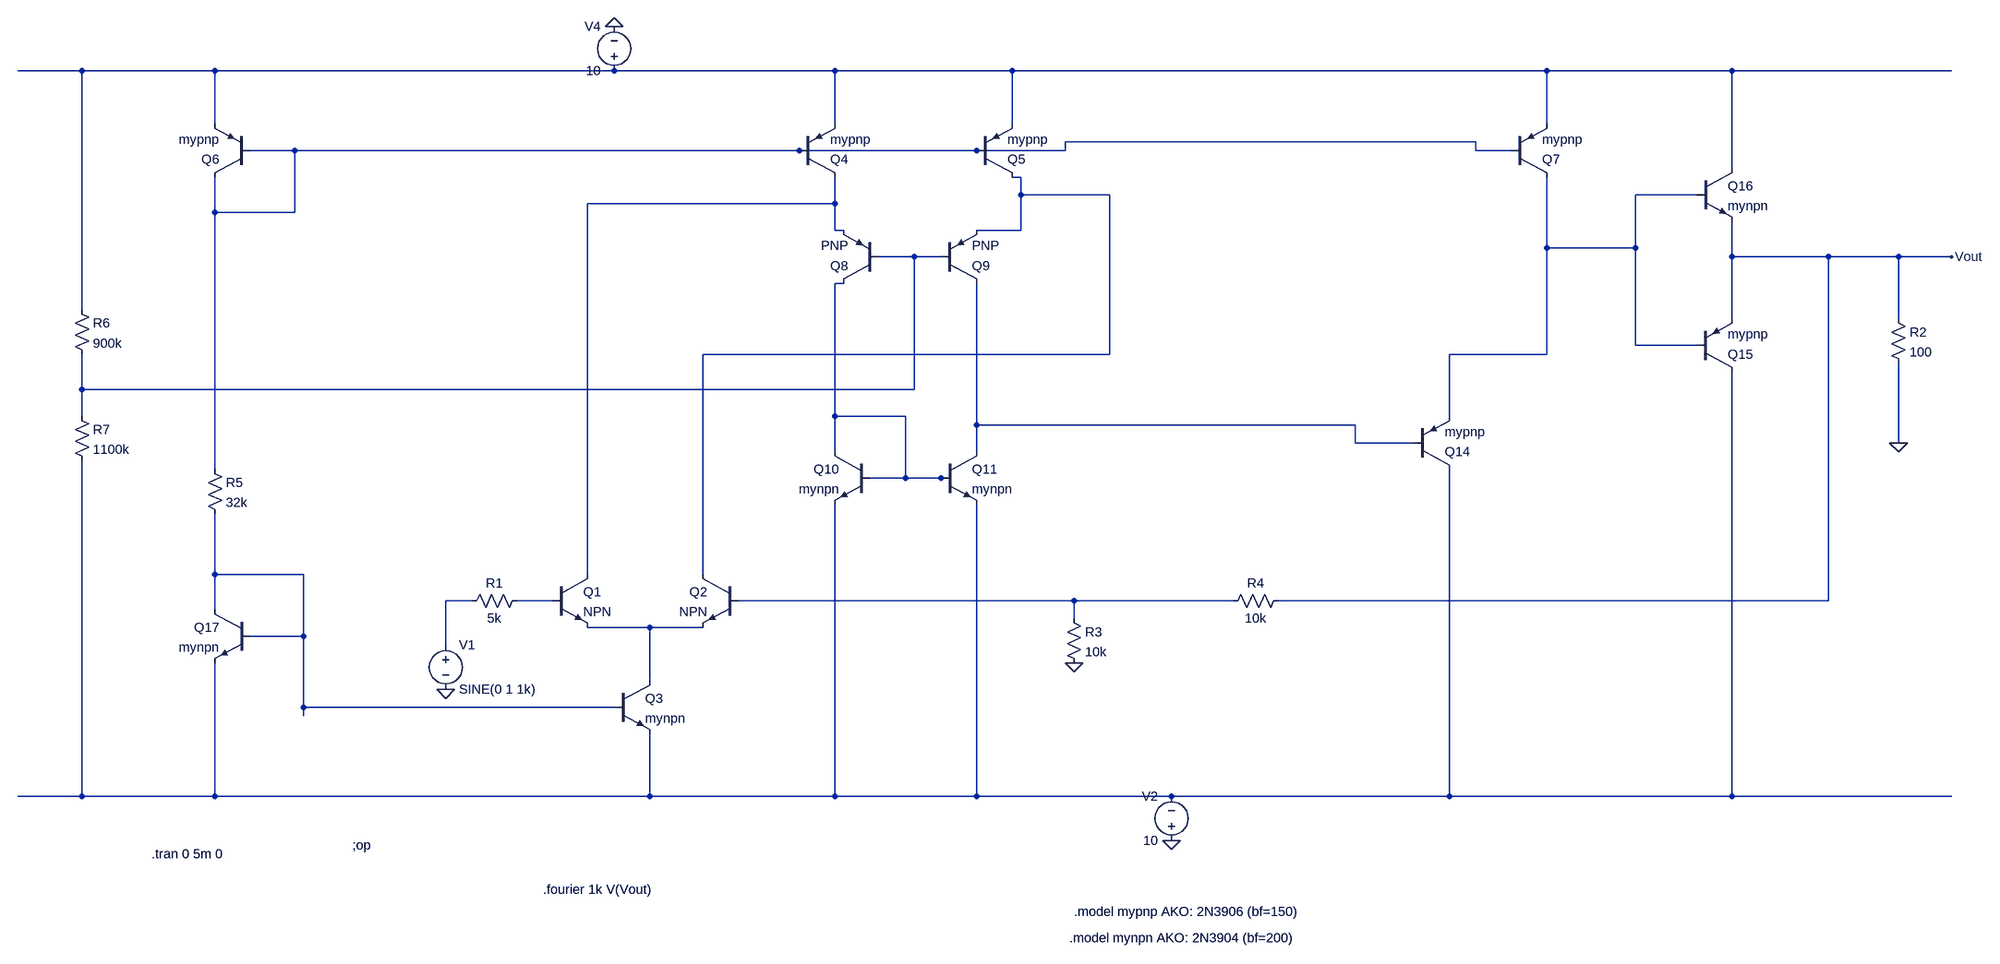
[diagram p0: schematic p2.asc]
p2.asc, the LTspice schematic file:
Version 4
SHEET 1 3304 880
WIRE -736 -816 -912 -816
WIRE -496 -816 -736 -816
WIRE 288 -816 -496 -816
WIRE 816 -816 288 -816
WIRE 1136 -816 816 -816
WIRE 2208 -816 1136 -816
WIRE 2544 -816 2208 -816
WIRE 3232 -816 2544 -816
WIRE -496 -720 -496 -816
WIRE 816 -720 816 -816
WIRE 1136 -720 1136 -816
WIRE 2208 -720 2208 -816
WIRE 2080 -688 1232 -688
WIRE -352 -672 -432 -672
WIRE 752 -672 -352 -672
WIRE 1072 -672 752 -672
WIRE 1232 -672 1232 -688
WIRE 1232 -672 1072 -672
WIRE 2080 -672 2080 -688
WIRE 2144 -672 2080 -672
WIRE 2544 -640 2544 -816
WIRE 1152 -624 1136 -624
WIRE 1152 -592 1152 -624
WIRE 1312 -592 1152 -592
WIRE 2480 -592 2368 -592
WIRE 816 -576 816 -624
WIRE 816 -576 240 -576
WIRE -496 -560 -496 -624
WIRE -352 -560 -352 -672
WIRE -352 -560 -496 -560
WIRE 816 -528 816 -576
WIRE 832 -528 816 -528
WIRE 1152 -528 1152 -592
WIRE 1152 -528 1072 -528
WIRE 2208 -496 2208 -624
WIRE 2368 -496 2368 -592
WIRE 2368 -496 2208 -496
WIRE 960 -480 896 -480
WIRE 1008 -480 960 -480
WIRE 2544 -480 2544 -544
WIRE 2848 -480 2544 -480
WIRE 3136 -480 2848 -480
WIRE 3232 -480 3136 -480
WIRE 832 -432 816 -432
WIRE -736 -384 -736 -816
WIRE 2544 -368 2544 -480
WIRE 3136 -368 3136 -480
WIRE 2368 -320 2368 -496
WIRE 2480 -320 2368 -320
WIRE 1312 -304 1312 -592
WIRE 1312 -304 448 -304
WIRE 2208 -304 2208 -496
WIRE 2208 -304 2032 -304
WIRE -736 -240 -736 -304
WIRE 960 -240 960 -480
WIRE 960 -240 -736 -240
WIRE -736 -192 -736 -240
WIRE 816 -192 816 -432
WIRE 944 -192 816 -192
WIRE 2032 -192 2032 -304
WIRE 1072 -176 1072 -432
WIRE 1792 -176 1072 -176
WIRE 1792 -144 1792 -176
WIRE 1968 -144 1792 -144
WIRE 3136 -144 3136 -288
WIRE 816 -128 816 -192
WIRE 1072 -128 1072 -176
WIRE -496 -96 -496 -560
WIRE 944 -80 944 -192
WIRE 944 -80 880 -80
WIRE 1008 -80 944 -80
WIRE 1024 -80 1008 -80
WIRE -496 192 -496 -16
WIRE -336 192 -496 192
WIRE 240 192 240 -576
WIRE 448 192 448 -304
WIRE 32 240 -16 240
WIRE 176 240 112 240
WIRE 1248 240 512 240
WIRE 1536 240 1248 240
WIRE 2848 240 2848 -480
WIRE 2848 240 1616 240
WIRE -496 256 -496 192
WIRE 1248 272 1248 240
WIRE 352 288 240 288
WIRE 448 288 352 288
WIRE -336 304 -336 192
WIRE -336 304 -432 304
WIRE -16 320 -16 240
WIRE 352 384 352 288
WIRE -336 432 -336 304
WIRE 288 432 -336 432
WIRE -336 448 -336 432
WIRE -736 608 -736 -112
WIRE -736 608 -912 608
WIRE -496 608 -496 352
WIRE -496 608 -736 608
WIRE 352 608 352 480
WIRE 352 608 -496 608
WIRE 816 608 816 -32
WIRE 816 608 352 608
WIRE 1072 608 1072 -32
WIRE 1072 608 816 608
WIRE 1424 608 1072 608
WIRE 2032 608 2032 -96
WIRE 2032 608 1424 608
WIRE 2544 608 2544 -272
WIRE 2544 608 2032 608
WIRE 3232 608 2544 608
FLAG -16 400 0
FLAG 1424 688 0
FLAG 3136 -144 0
FLAG 3232 -480 Vout
FLAG 288 -896 0
FLAG 1248 352 0
SYMBOL res 128 224 R90
WINDOW 0 0 56 VBottom 2
WINDOW 3 32 56 VTop 2
SYMATTR InstName R1
SYMATTR Value 5k
SYMBOL voltage -16 304 R0
WINDOW 123 0 0 Left 0
WINDOW 39 0 0 Left 0
SYMATTR InstName V1
SYMATTR Value SINE(0 1 1k)
SYMBOL npn 176 192 R0
SYMATTR InstName Q1
SYMBOL npn 512 192 M0
SYMATTR InstName Q2
SYMBOL npn 288 384 R0
SYMATTR InstName Q3
SYMATTR Value mynpn
SYMBOL voltage 1424 704 R180
WINDOW 0 24 96 Left 2
WINDOW 3 24 16 Left 2
WINDOW 123 0 0 Left 0
WINDOW 39 0 0 Left 0
SYMATTR InstName V2
SYMATTR Value 10
SYMBOL pnp 752 -624 M180
SYMATTR InstName Q4
SYMATTR Value mypnp
SYMBOL pnp 1072 -624 M180
SYMATTR InstName Q5
SYMATTR Value mypnp
SYMBOL pnp 2144 -624 M180
SYMATTR InstName Q7
SYMATTR Value mypnp
SYMBOL pnp 896 -432 R180
SYMATTR InstName Q8
SYMBOL pnp 1008 -432 M180
SYMATTR InstName Q9
SYMBOL npn 880 -128 M0
SYMATTR InstName Q10
SYMATTR Value mynpn
SYMBOL npn 1008 -128 R0
SYMATTR InstName Q11
SYMATTR Value mynpn
SYMBOL pnp 1968 -96 M180
SYMATTR InstName Q14
SYMATTR Value mypnp
SYMBOL pnp 2480 -272 M180
SYMATTR InstName Q15
SYMATTR Value mypnp
SYMBOL npn 2480 -640 R0
SYMATTR InstName Q16
SYMATTR Value mynpn
SYMBOL res 3120 -384 R0
SYMATTR InstName R2
SYMATTR Value 100
SYMBOL res 1632 224 R90
WINDOW 0 0 56 VBottom 2
WINDOW 3 32 56 VTop 2
SYMATTR InstName R4
SYMATTR Value 10k
SYMBOL npn -432 256 M0
SYMATTR InstName Q17
SYMATTR Value mynpn
SYMBOL res -512 -112 R0
SYMATTR InstName R5
SYMATTR Value 32k
SYMBOL pnp -432 -624 R180
SYMATTR InstName Q6
SYMATTR Value mypnp
SYMBOL voltage 288 -800 R180
WINDOW 0 24 96 Left 2
WINDOW 3 24 16 Left 2
WINDOW 123 0 0 Left 0
WINDOW 39 0 0 Left 0
SYMATTR InstName V4
SYMATTR Value 10
SYMBOL res 1232 256 R0
SYMATTR InstName R3
SYMATTR Value 10k
SYMBOL res -752 -400 R0
SYMATTR InstName R6
SYMATTR Value 900k
SYMBOL res -752 -208 R0
SYMATTR InstName R7
SYMATTR Value 1100k
TEXT -610 712 Left 2 !.tran 0 5m 0
TEXT 1248 816 Left 2 !.model mypnp AKO: 2N3906 (bf=150)
TEXT 1240 864 Left 2 !.model mynpn AKO: 2N3904 (bf=200)
TEXT -248 696 Left 2 !;op
TEXT 160 776 Left 2 !.fourier 1k V(Vout)

The netlist it stands for:
* p2.asc
R1 N011 N010 5k
V1 N010 0 SINE(0 1 1k)
Q1 N005 N011 N013 0 NPN
Q2 N003 N012 N013 0 NPN
Q3 N013 N009 N014 0 mynpn
V2 0 N014 10
Q4 N005 N002 N001 0 mypnp
Q5 N003 N002 N001 0 mypnp
Q7 N004 N002 N001 0 mypnp
Q8 N007 N006 N005 0 PNP
Q9 N008 N006 N003 0 PNP
Q10 N007 N007 N014 0 mynpn
Q11 N008 N007 N014 0 mynpn
Q14 N014 N008 N004 0 mypnp
Q15 N014 N004 Vout 0 mypnp
Q16 N001 N004 Vout 0 mynpn
R2 Vout 0 100
R4 Vout N012 10k
Q17 N009 N009 N014 0 mynpn
R5 N002 N009 32k
Q6 N002 N002 N001 0 mypnp
V4 N001 0 10
R3 N012 0 10k
R6 N001 N006 900k
R7 N006 N014 1100k
.model NPN NPN
.model PNP PNP
.lib standard.bjt
.tran 0 5m 0
.model mypnp AKO: 2N3906 (bf=150)
.model mynpn AKO: 2N3904 (bf=200)
;op
.fourier 1k V(Vout)
.backanno
.end